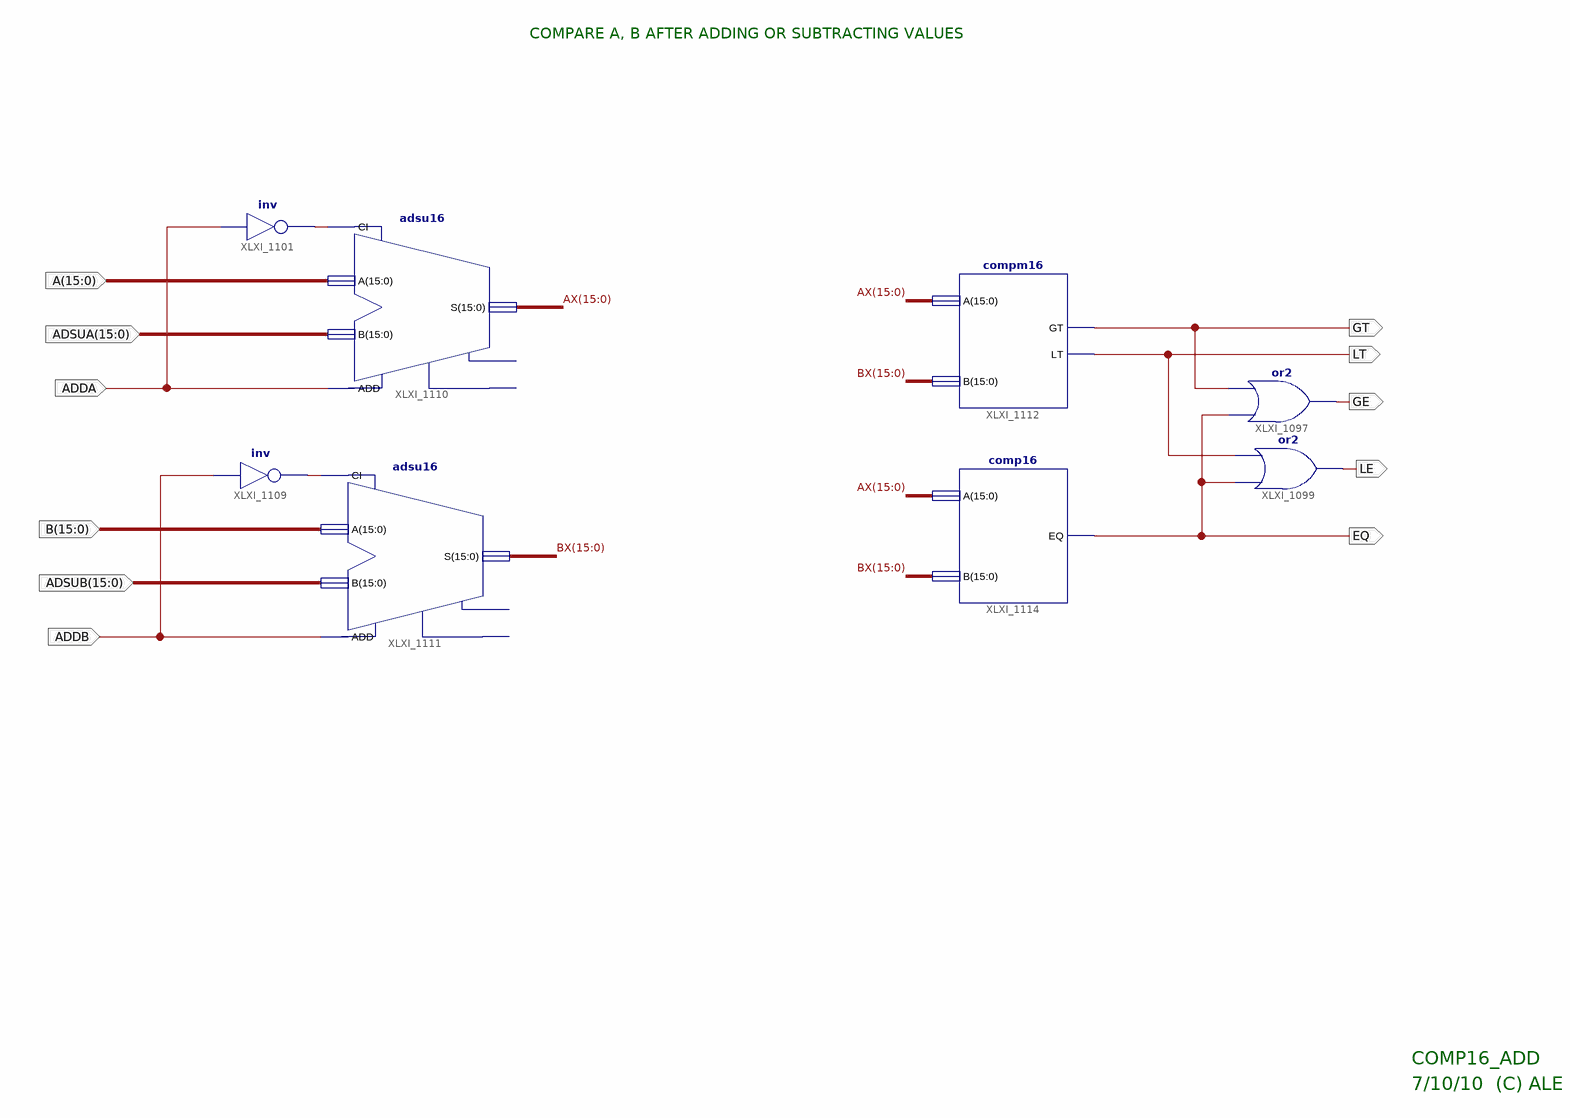
[diagram p0: schematic sheet 1]
// Xilinx ISE schematic DB_Comp16_add.sch (spartan3e) as structural Verilog: 8 symbols, 11 ports
module DB_Comp16_add (
  input  [15:0] A,
  input  [15:0] ADSUA,
  input  ADDA,
  input  [15:0] B,
  input  [15:0] ADSUB,
  input  ADDB,
  output GT,
  output LT,
  output EQ,
  output GE,
  output LE
);

  wire XLXN_20, XLXN_43;
  wire [15:0] AX, BX;

  or XLXI_1097 (GE, EQ, GT);
  or XLXI_1099 (LE, EQ, LT);
  not XLXI_1101 (XLXN_20, ADDA);
  not XLXI_1109 (XLXN_43, ADDB);
  adsu16 XLXI_1110 (.A(A), .ADD(ADDA), .B(ADSUA), .CI(XLXN_20), .S(AX));  // open: CO, OFL
  adsu16 XLXI_1111 (.A(B), .ADD(ADDB), .B(ADSUB), .CI(XLXN_43), .S(BX));  // open: CO, OFL
  compm16 XLXI_1112 (.A(AX), .B(BX), .GT(GT), .LT(LT));
  comp16 XLXI_1114 (.A(AX), .B(BX), .EQ(EQ));

  // Notes on the sheet:
  //   COMPARE A, B AFTER ADDING OR SUBTRACTING VALUES
  //   COMP16_ADD
  //   7/10/10  (C) ALE
endmodule
